# EAGLE design board (EAGLE 7.6.0)
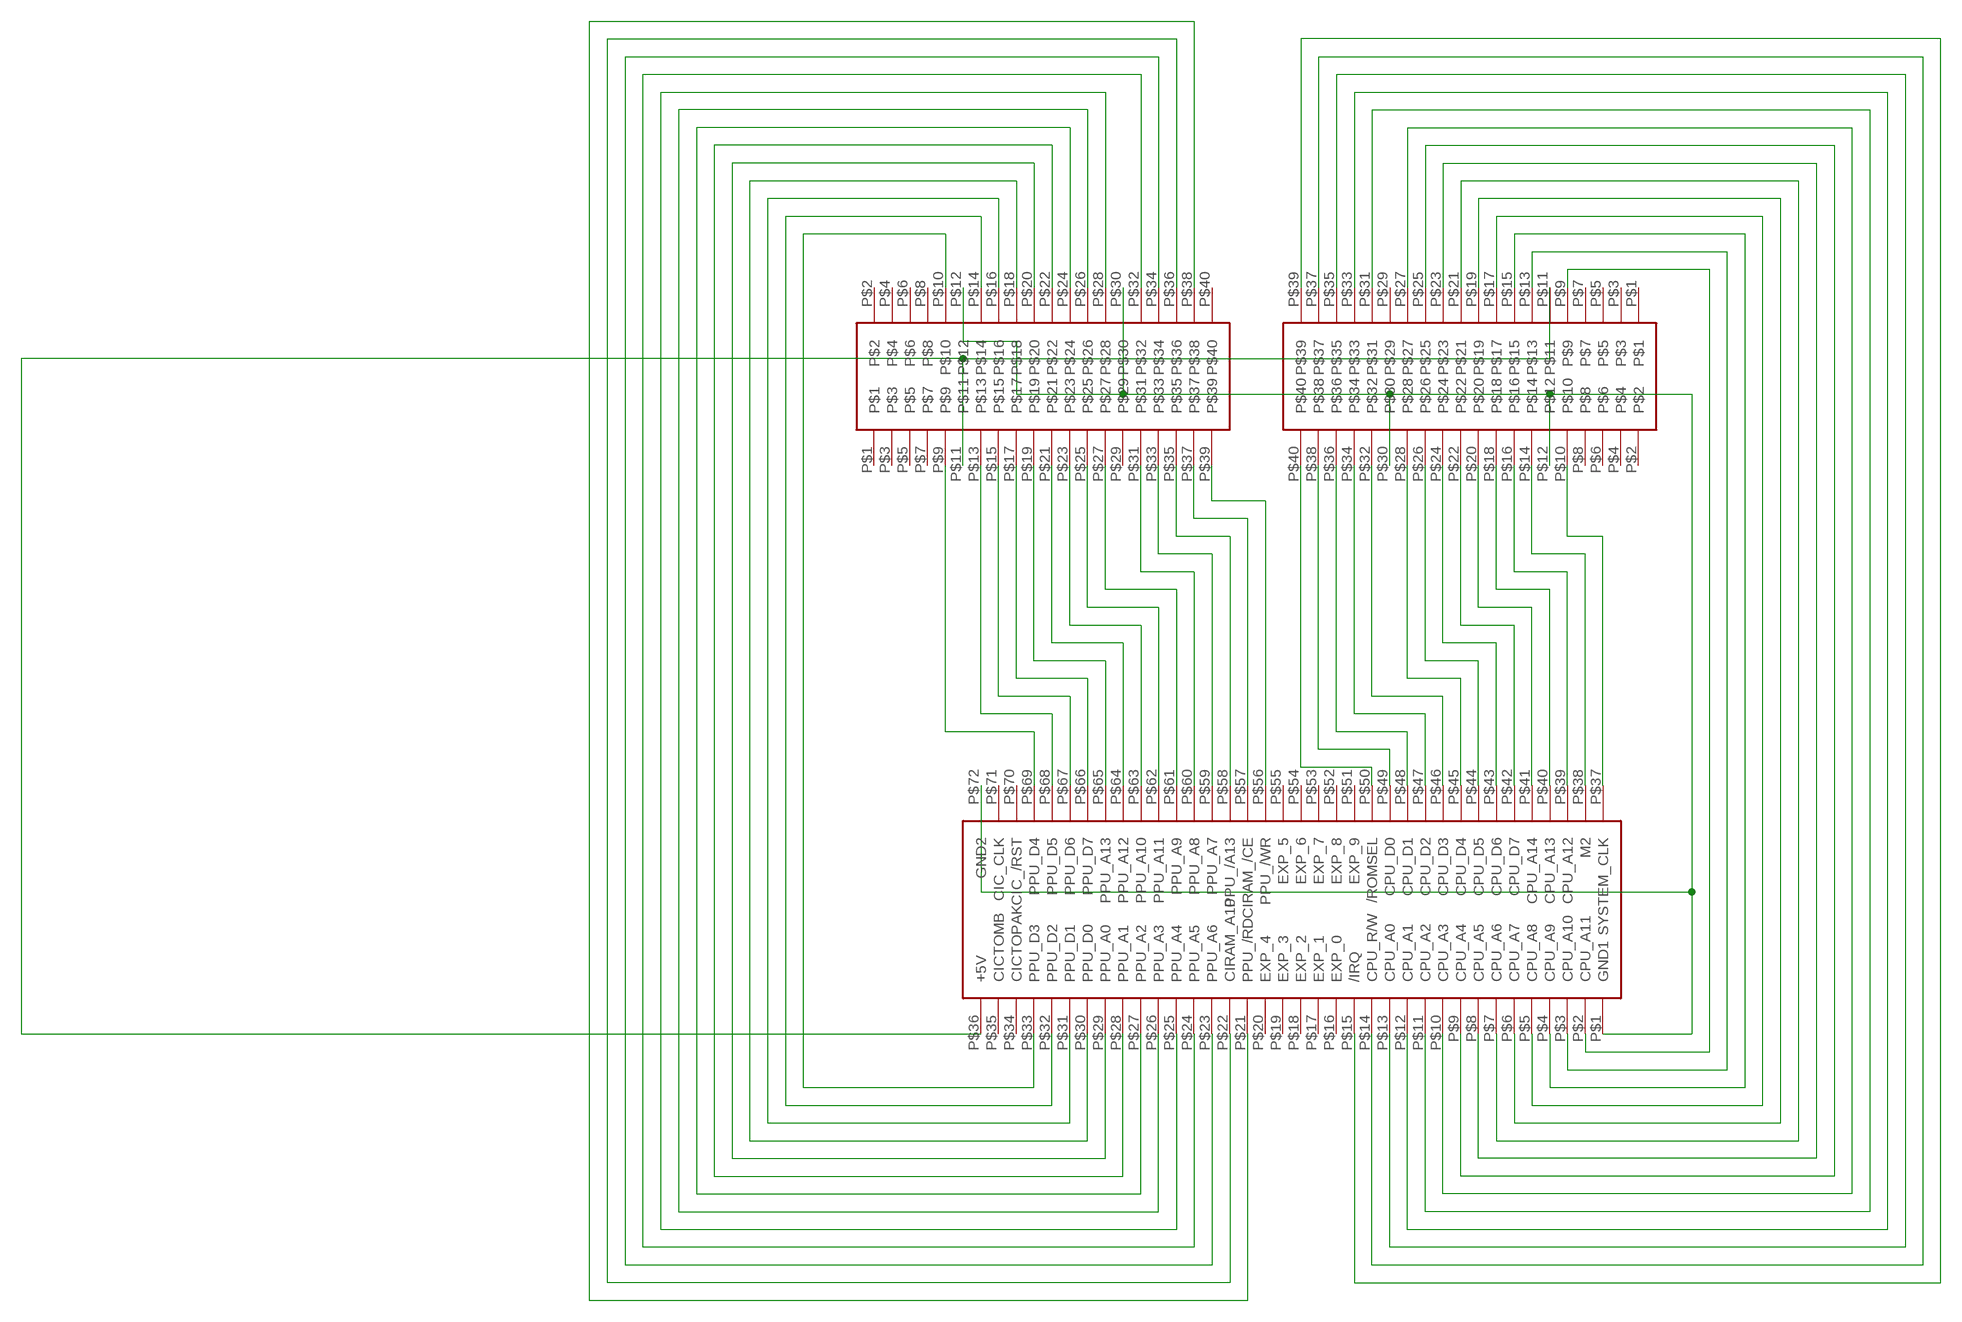
[diagram p0: schematic, sheet 1]

## Parts
U$1  NES_CONN  [36X2]
U$2  40PINNER  [40PINNER]
U$3  40PINNER  [40PINNER]

## Nets
N$1: U$1.P$1(GND1) U$1.P$72(GND2) U$2.P$12 U$2.P$30 U$3.P$12 U$3.P$30
N$2: U$1.P$2(CPU_A11) U$3.P$9
N$3: U$1.P$50(/ROMSEL) U$3.P$40
N$4: U$1.P$49(CPU_D0) U$3.P$38
N$5: U$1.P$3(CPU_A10) U$3.P$13
N$6: U$1.P$4(CPU_A9) U$3.P$15
N$7: U$1.P$48(CPU_D1) U$3.P$36
N$8: U$1.P$47(CPU_D2) U$3.P$34
N$9: U$1.P$46(CPU_D3) U$3.P$32
N$10: U$1.P$5(CPU_A8) U$3.P$17
N$11: U$1.P$6(CPU_A7) U$3.P$19
N$12: U$1.P$36(+5V) U$2.P$11 U$3.P$11
N$13: U$1.P$45(CPU_D4) U$3.P$28
N$14: U$1.P$44(CPU_D5) U$3.P$26
N$15: U$1.P$43(CPU_D6) U$3.P$24
N$16: U$1.P$42(CPU_D7) U$3.P$22
N$17: U$1.P$41(CPU_A14) U$3.P$20
N$18: U$1.P$40(CPU_A13) U$3.P$18
N$19: U$1.P$39(CPU_A12) U$3.P$16
N$20: U$1.P$38(M2) U$3.P$14
N$21: U$1.P$37(SYSTEM_CLK) U$3.P$10
N$23: U$1.P$7(CPU_A6) U$3.P$21
N$24: U$1.P$8(CPU_A5) U$3.P$23
N$25: U$1.P$9(CPU_A4) U$3.P$25
N$26: U$1.P$10(CPU_A3) U$3.P$27
N$27: U$1.P$11(CPU_A2) U$3.P$31
N$28: U$1.P$12(CPU_A1) U$3.P$33
N$29: U$1.P$13(CPU_A0) U$3.P$35
N$30: U$1.P$14(CPU_R/W) U$3.P$37
N$31: U$1.P$15(/IRQ) U$3.P$39
N$33: U$1.P$69(PPU_D4) U$2.P$9
N$34: U$1.P$68(PPU_D5) U$2.P$13
N$35: U$1.P$67(PPU_D6) U$2.P$15
N$36: U$1.P$66(PPU_D7) U$2.P$17
N$37: U$1.P$65(PPU_A13) U$2.P$19
N$38: U$1.P$64(PPU_A12) U$2.P$21
N$39: U$1.P$63(PPU_A10) U$2.P$23
N$40: U$1.P$62(PPU_A11) U$2.P$25
N$41: U$1.P$61(PPU_A9) U$2.P$27
N$42: U$1.P$60(PPU_A8) U$2.P$31
N$43: U$1.P$59(PPU_A7) U$2.P$33
N$44: U$1.P$58(PPU_/A13) U$2.P$35
N$45: U$1.P$57(CIRAM_/CE) U$2.P$37
N$46: U$1.P$56(PPU_/WR) U$2.P$39
N$49: U$1.P$33(PPU_D3) U$2.P$10
N$50: U$1.P$32(PPU_D2) U$2.P$14
N$51: U$1.P$31(PPU_D1) U$2.P$16
N$52: U$1.P$30(PPU_D0) U$2.P$18
N$53: U$1.P$29(PPU_A0) U$2.P$20
N$54: U$1.P$28(PPU_A1) U$2.P$22
N$55: U$1.P$27(PPU_A2) U$2.P$24
N$56: U$1.P$26(PPU_A3) U$2.P$26
N$57: U$1.P$25(PPU_A4) U$2.P$28
N$58: U$1.P$24(PPU_A5) U$2.P$32
N$59: U$1.P$23(PPU_A6) U$2.P$34
N$60: U$1.P$22(CIRAM_A10) U$2.P$36
N$61: U$1.P$21(PPU_/RD) U$2.P$38
Unconnected: U$1.P$16(EXP_0) U$1.P$17(EXP_1) U$1.P$18(EXP_2) U$1.P$19(EXP_3) U$1.P$20(EXP_4) U$1.P$34(CICTOPAK) U$1.P$35(CICTOMB) U$1.P$51(EXP_9) U$1.P$52(EXP_8) U$1.P$53(EXP_7) U$1.P$54(EXP_6) U$1.P$55(EXP_5) U$1.P$70(CIC_/RST) U$1.P$71(CIC_CLK) U$2.P$1 U$2.P$2 U$2.P$3 U$2.P$4 U$2.P$5 U$2.P$6 U$2.P$7 U$2.P$8 U$2.P$29 U$2.P$40 U$3.P$1 U$3.P$2 U$3.P$3 U$3.P$4 U$3.P$5 U$3.P$6 U$3.P$7 U$3.P$8 U$3.P$29

## Library data of the parts
U$1 = NES:NES_CONN: NES
U$2 U$3 = NES:40PINNER

## Board
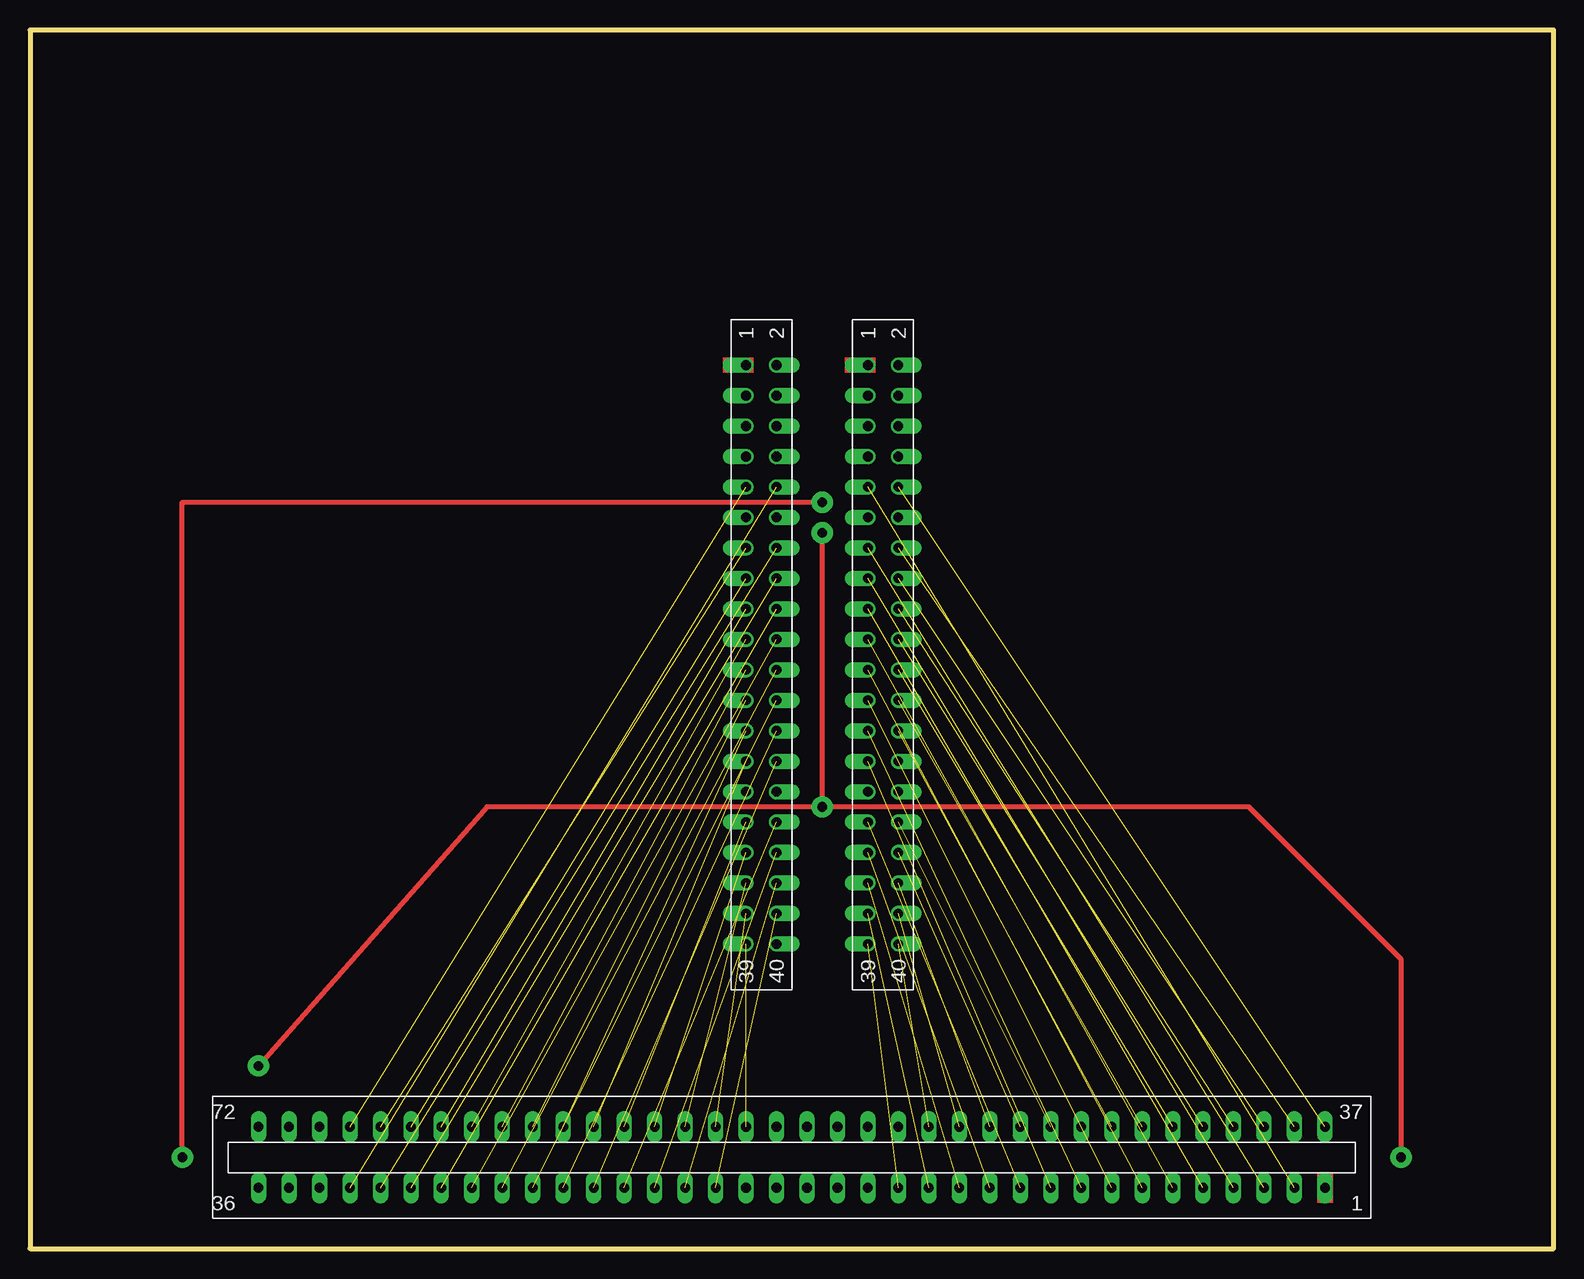
[diagram p1: board, top side]
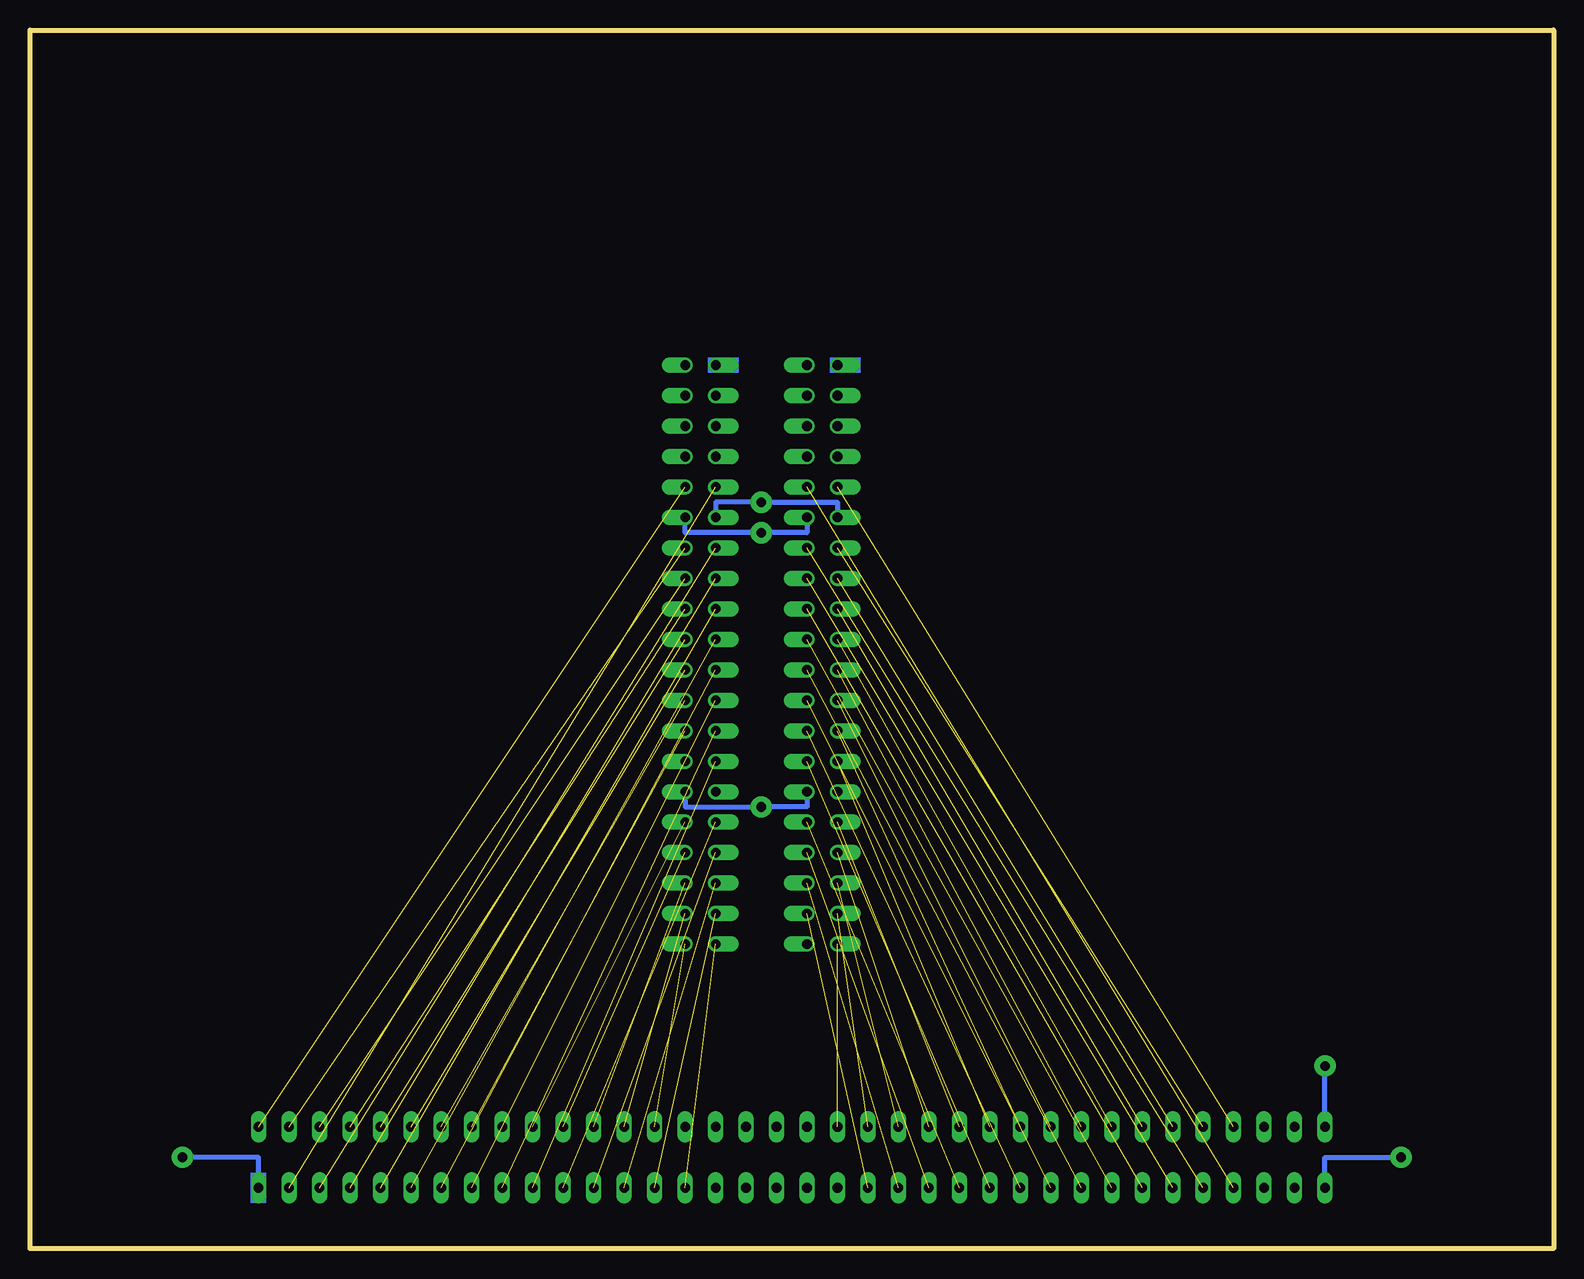
[diagram p2: board, bottom side, seen from below]

Size 127 x 101.6 mm. Coordinates in mm from the lower left corner, seen from the top.
Outline: 0,0 127,0 127,101.6 0,101.6 0,0
Copper layers (1*16): Top 0.035mm / dielectric 1.5mm / Bottom 0.035mm
Design rules "default *": minimum track width 16mil, minimum drill 24mil, track to track 16mil, track to pad 16mil, pad to pad 16mil, via to via 16mil, smd to smd 16mil, copper to edge 40mil, drill to drill 16mil, minimum pad ring 10mil, minimum via ring 8mil, stop-mask expansion 4mil, vias tented up to drill 0mil, thermal gap 10mil

### Footprints (pad centres in the part's own frame; a part is rotated, then mirrored left to right if it is on the bottom)
36X2 = drill 0.8 long: P$1 -44.45,2.54; P$2 -41.91,2.54; P$3 -39.37,2.54; P$4 -36.83,2.54; P$5 -34.29,2.54; P$6 -31.75,2.54; P$7 -29.21,2.54; P$8 -26.67,2.54; P$9 -24.13,2.54; P$10 -21.59,2.54; P$11 -19.05,2.54; P$12 -16.51,2.54; P$13 -13.97,2.54; P$14 -11.43,2.54; P$15 -8.89,2.54; P$16 -6.35,2.54; P$17 -3.81,2.54; P$18 -1.27,2.54; P$19 1.27,2.54; P$20 3.81,2.54; P$21 6.35,2.54; P$22 8.89,2.54; P$23 11.43,2.54; P$24 13.97,2.54; P$25 16.51,2.54; P$26 19.05,2.54; P$27 21.59,2.54; P$28 24.13,2.54; P$29 26.67,2.54; P$30 29.21,2.54; P$31 31.75,2.54; P$32 34.29,2.54; P$33 36.83,2.54; P$34 39.37,2.54; P$35 41.91,2.54; P$36 44.45,2.54; P$37 -44.45,-2.54; P$38 -41.91,-2.54; P$39 -39.37,-2.54; P$40 -36.83,-2.54; P$41 -34.29,-2.54; P$42 -31.75,-2.54; P$43 -29.21,-2.54; P$44 -26.67,-2.54; P$45 -24.13,-2.54; P$46 -21.59,-2.54; P$47 -19.05,-2.54; P$48 -16.51,-2.54; P$49 -13.97,-2.54; P$50 -11.43,-2.54; P$51 -8.89,-2.54; P$52 -6.35,-2.54; P$53 -3.81,-2.54; P$54 -1.27,-2.54; P$55 1.27,-2.54; P$56 3.81,-2.54; P$57 6.35,-2.54; P$58 8.89,-2.54; P$59 11.43,-2.54; P$60 13.97,-2.54; P$61 16.51,-2.54; P$62 19.05,-2.54; P$63 21.59,-2.54; P$64 24.13,-2.54; P$65 26.67,-2.54; P$66 29.21,-2.54; P$67 31.75,-2.54; P$68 34.29,-2.54; P$69 36.83,-2.54; P$70 39.37,-2.54; P$71 41.91,-2.54; P$72 44.45,-2.54
40PINNER = drill 0.8 offset: P$1 -16.51,-1.27; P$2 -16.51,1.27; P$3 -13.97,-1.27; P$4 -13.97,1.27; P$5 -11.43,-1.27; P$6 -11.43,1.27; P$7 -8.89,-1.27; P$8 -8.89,1.27; P$9 -6.35,-1.27; P$10 -6.35,1.27; P$11 -3.81,-1.27; P$12 -3.81,1.27; P$13 -1.27,-1.27; P$14 -1.27,1.27; P$15 1.27,-1.27; P$16 1.27,1.27; P$17 3.81,-1.27; P$18 3.81,1.27; P$19 6.35,-1.27; P$20 6.35,1.27; P$21 8.89,-1.27; P$22 8.89,1.27; P$23 11.43,-1.27; P$24 11.43,1.27; P$25 13.97,-1.27; P$26 13.97,1.27; P$27 16.51,-1.27; P$28 16.51,1.27; P$29 19.05,-1.27; P$30 19.05,1.27; P$31 21.59,-1.27; P$32 21.59,1.27; P$33 24.13,-1.27; P$34 24.13,1.27; P$35 26.67,-1.27; P$36 26.67,1.27; P$37 29.21,-1.27; P$38 29.21,1.27; P$39 31.75,-1.27; P$40 31.75,1.27

### Placement (x,y rotation side)
U$1  63.5,7.62 180 top
U$2  60.96,57.15 270 top
U$3  71.12,57.15 270 top

### Tracks (layer width: path | path; a pad name or v marks a point on that pad's centre or on a via)
N$1  (via drill 0.8 pad 1.78)
  Top 0.406: v66.04,36.83 38.1,36.83 v19.05,15.24 | v114.3,7.62 114.3,24.13 101.6,36.83 v66.04,36.83 | v66.04,59.69 v66.04,36.83
  Bottom 0.406: U$2.P$30 62.23,36.83 v66.04,36.83 72.39,36.83 U$3.P$30 | U$2.P$12 62.23,59.69 v66.04,59.69 72.39,59.69 U$3.P$12 | U$1.P$72 v19.05,15.24 | U$1.P$1 107.95,7.62 v114.3,7.62
N$2  (1 unrouted)
N$3  (1 unrouted)
N$4  (1 unrouted)
N$5  (1 unrouted)
N$6  (1 unrouted)
N$7  (1 unrouted)
N$8  (1 unrouted)
N$9  (1 unrouted)
N$10  (1 unrouted)
N$11  (1 unrouted)
N$12  (via drill 0.8 pad 1.78)
  Top 0.406: v66.04,62.23 12.7,62.23 v12.7,7.62
  Bottom 0.406: U$3.P$11 69.85,62.23 v66.04,62.23 59.69,62.23 U$2.P$11 | U$1.P$36 19.05,7.62 v12.7,7.62
N$13  (1 unrouted)
N$14  (1 unrouted)
N$15  (1 unrouted)
N$16  (1 unrouted)
N$17  (1 unrouted)
N$18  (1 unrouted)
N$19  (1 unrouted)
N$20  (1 unrouted)
N$21  (1 unrouted)
N$23  (1 unrouted)
N$24  (1 unrouted)
N$25  (1 unrouted)
N$26  (1 unrouted)
N$27  (1 unrouted)
N$28  (1 unrouted)
N$29  (1 unrouted)
N$30  (1 unrouted)
N$31  (1 unrouted)
N$33  (1 unrouted)
N$34  (1 unrouted)
N$35  (1 unrouted)
N$36  (1 unrouted)
N$37  (1 unrouted)
N$38  (1 unrouted)
N$39  (1 unrouted)
N$40  (1 unrouted)
N$41  (1 unrouted)
N$42  (1 unrouted)
N$43  (1 unrouted)
N$44  (1 unrouted)
N$45  (1 unrouted)
N$46  (1 unrouted)
N$49  (1 unrouted)
N$50  (1 unrouted)
N$51  (1 unrouted)
N$52  (1 unrouted)
N$53  (1 unrouted)
N$54  (1 unrouted)
N$55  (1 unrouted)
N$56  (1 unrouted)
N$57  (1 unrouted)
N$58  (1 unrouted)
N$59  (1 unrouted)
N$60  (1 unrouted)
N$61  (1 unrouted)